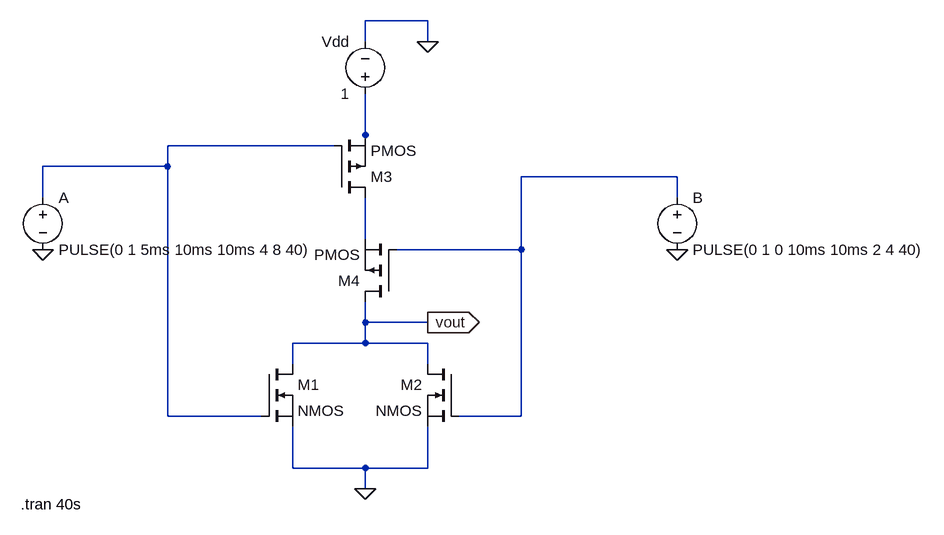
[diagram p0: schematic nor_gate.asc]
nor_gate.asc, the LTspice schematic file:
Version 4
SHEET 1 880 680
WIRE -160 -1280 -256 -1280
WIRE -256 -1248 -256 -1280
WIRE -160 -1248 -160 -1280
WIRE -256 -1104 -256 -1168
WIRE -304 -1088 -560 -1088
WIRE -256 -1088 -256 -1104
WIRE -560 -1056 -560 -1088
WIRE -560 -1056 -752 -1056
WIRE 224 -1040 -16 -1040
WIRE -752 -1008 -752 -1056
WIRE 224 -1008 224 -1040
WIRE -256 -944 -256 -1008
WIRE -16 -928 -16 -1040
WIRE -16 -928 -208 -928
WIRE -256 -816 -256 -848
WIRE -160 -816 -256 -816
WIRE -256 -784 -256 -816
WIRE -256 -784 -368 -784
WIRE -160 -784 -256 -784
WIRE -368 -752 -368 -784
WIRE -160 -752 -160 -784
WIRE -560 -672 -560 -1056
WIRE -416 -672 -560 -672
WIRE -16 -672 -16 -928
WIRE -16 -672 -112 -672
WIRE -368 -592 -368 -656
WIRE -256 -592 -368 -592
WIRE -160 -592 -160 -656
WIRE -160 -592 -256 -592
WIRE -256 -560 -256 -592
FLAG -160 -1248 0
FLAG -752 -928 0
FLAG 224 -928 0
FLAG -256 -560 0
FLAG -160 -816 vout
IOPIN -160 -816 Out
SYMBOL nmos -416 -752 R0
SYMATTR InstName M1
SYMBOL nmos -112 -752 M0
SYMATTR InstName M2
SYMBOL pmos -304 -1008 M180
SYMATTR InstName M3
SYMBOL pmos -208 -848 R180
SYMATTR InstName M4
SYMBOL voltage -752 -1024 R0
WINDOW 123 0 0 Left 2
WINDOW 39 0 0 Left 2
SYMATTR InstName A
SYMATTR Value PULSE(0 1 5ms 10ms 10ms 4 8 40)
SYMBOL voltage 224 -1024 R0
WINDOW 123 0 0 Left 2
WINDOW 39 0 0 Left 2
SYMATTR InstName B
SYMATTR Value PULSE(0 1 0 10ms 10ms 2 4 40)
SYMBOL voltage -256 -1152 R180
WINDOW 0 24 96 Left 2
WINDOW 3 24 16 Left 2
WINDOW 123 0 0 Left 2
WINDOW 39 0 0 Left 2
SYMATTR InstName Vdd
SYMATTR Value 1
TEXT -786 -536 Left 2 !.tran 40s

The netlist it stands for:
* nor_gate.asc
M1 vout N002 0 0 NMOS
M2 vout N003 0 0 NMOS
M3 N004 N002 N001 N001 PMOS
M4 vout N003 N004 N004 PMOS
V§A N002 0 PULSE(0 1 5ms 10ms 10ms 4 8 40)
V§B N003 0 PULSE(0 1 0 10ms 10ms 2 4 40)
Vdd N001 0 1
.model NMOS NMOS
.model PMOS PMOS
.lib standard.mos
.tran 40s
.backanno
.end